# Altium project BB8_BMS.PrjPcb (part 1 of 2)
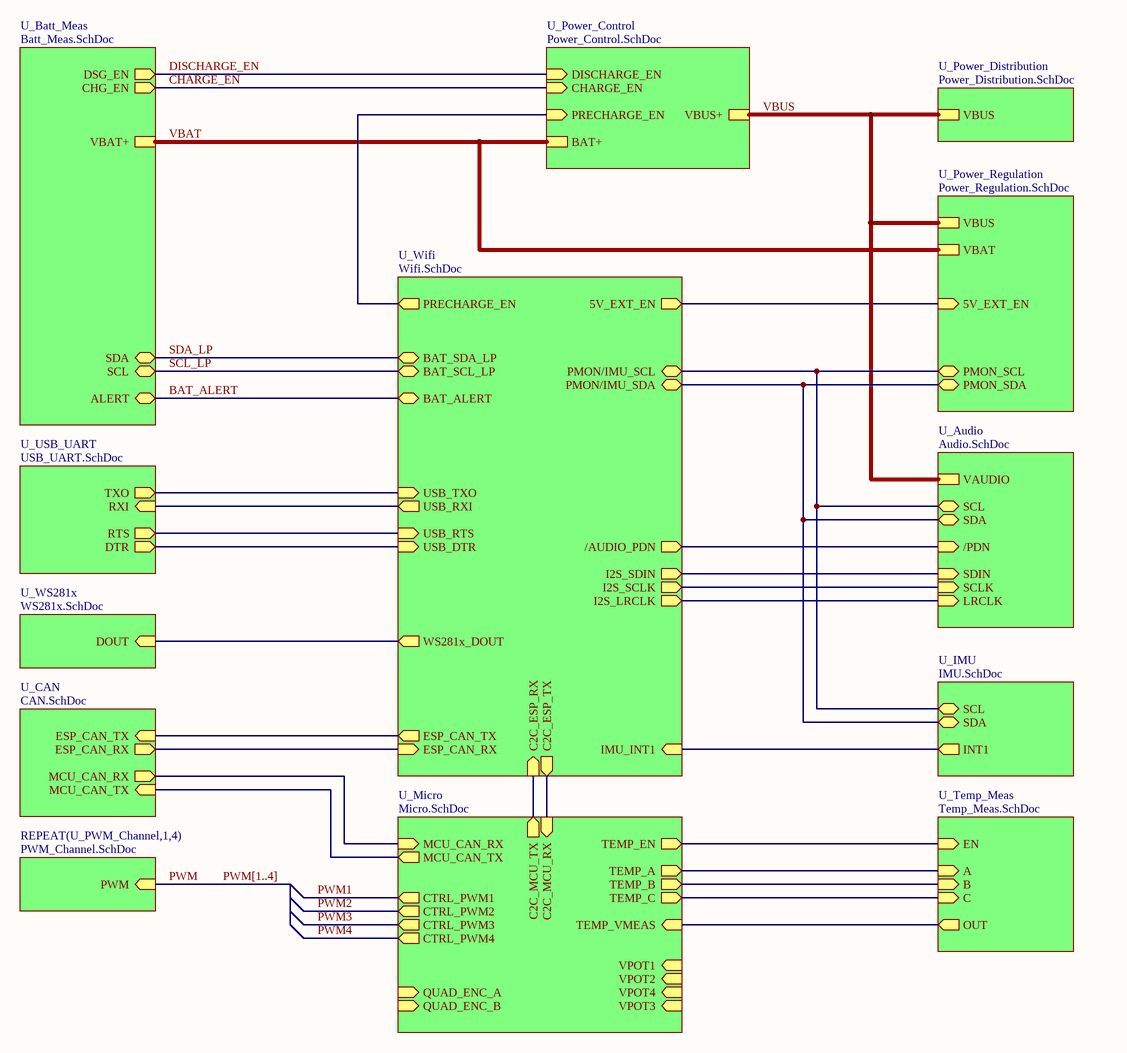
[diagram p0: BB8_BMS.SchDoc]
17 sheets, 214 parts. Net scope: hierarchical (ports join the sheet entries above them; power ports are global).
Board file: BB8_BMS.PcbDoc
Sheets:
  BB8_BMS.SchDoc
    U_Batt_Meas = Batt_Meas.SchDoc
    U_Power_Control = Power_Control.SchDoc
    U_Wifi = Wifi.SchDoc
    U_Power_Distribution = Power_Distribution.SchDoc
    U_Power_Regulation = Power_Regulation.SchDoc
      U_3V3_Regulator = 3V3_Regulator.SchDoc
      U_Ext_Regulators = Ext_Regulators.SchDoc
    U_Temp_Meas = Temp_Meas.SchDoc
      U_Temp_Mux = Temp_Mux.SchDoc
    U_IMU = IMU.SchDoc
    U_USB_UART = USB_UART.SchDoc
    U_CAN = CAN.SchDoc
    U_Audio = Audio.SchDoc
    U_PWM_Channel1 = PWM_Channel.SchDoc
    U_PWM_Channel2 = PWM_Channel.SchDoc
    U_PWM_Channel3 = PWM_Channel.SchDoc
    U_PWM_Channel4 = PWM_Channel.SchDoc
    U_WS281x = WS281x.SchDoc
    U_Micro = Micro.SchDoc

## Sheet BB8_BMS.SchDoc
size B

### Sub-sheets
REPEAT(U_PWM_Channel,1,4) = PWM_Channel.SchDoc: PWM (in)
U_Audio = Audio.SchDoc: VAUDIO, /PDN (in), SDA (bidir), SCL (bidir), SDIN (in), SCLK (in), LRCLK (in)
U_Batt_Meas = Batt_Meas.SchDoc: SCL (bidir), SDA (bidir), VBAT+, CHG_EN (out), DSG_EN (out), ALERT (bidir)
U_CAN = CAN.SchDoc: MCU_CAN_RX (out), MCU_CAN_TX (in), ESP_CAN_TX (in), ESP_CAN_RX (out)
U_IMU = IMU.SchDoc: INT1 (out), SDA (bidir), SCL (bidir)
U_Micro = Micro.SchDoc: TEMP_A (out), TEMP_B (out), TEMP_VMEAS (in), TEMP_C (out), TEMP_EN (out), CTRL_PWM1 (out), CTRL_PWM2 (out), CTRL_PWM3 (out), CTRL_PWM4 (out), C2C_MCU_TX (out), C2C_MCU_RX (in), MCU_CAN_RX (in), MCU_CAN_TX (out), VPOT3 (in), VPOT1 (in), QUAD_ENC_A (in), VPOT4 (in), QUAD_ENC_B (in), VPOT2 (in)
U_Power_Control = Power_Control.SchDoc: BAT+, VBUS+, DISCHARGE_EN (in), CHARGE_EN (in), PRECHARGE_EN (in)
U_Power_Distribution = Power_Distribution.SchDoc: VBUS
U_Power_Regulation = Power_Regulation.SchDoc: VBUS, VBAT, 5V_EXT_EN (in), PMON_SCL (bidir), PMON_SDA (bidir)
U_Temp_Meas = Temp_Meas.SchDoc: A (in), B (in), OUT (out), C (in), EN (in)
U_USB_UART = USB_UART.SchDoc: RXI (in), TXO (out), RTS (out), DTR (out)
U_Wifi = Wifi.SchDoc: USB_TXO (in), USB_RXI (out), USB_RTS (in), USB_DTR (in), IMU_INT1 (in), BAT_ALERT (bidir), BAT_SCL_LP (bidir), BAT_SDA_LP (bidir), 5V_EXT_EN (out), PMON/IMU_SCL (bidir), PMON/IMU_SDA (bidir), PRECHARGE_EN (out), ESP_CAN_TX (out), ESP_CAN_RX (in), /AUDIO_PDN (out), I2S_SDIN (out), I2S_SCLK (out), I2S_LRCLK (out), WS281x_DOUT (out), C2C_ESP_RX (in), C2C_ESP_TX (out)
U_WS281x = WS281x.SchDoc: DOUT (in)

### Nets
5V_EN: sheet U_Wifi/5V_EXT_EN, sheet U_Power_Regulation/5V_EXT_EN
/BOOT: sheet U_Wifi//AUDIO_PDN, sheet U_Audio//PDN
A: sheet U_Temp_Meas/A, sheet U_Micro/TEMP_A
B: sheet U_Temp_Meas/B, sheet U_Micro/TEMP_B
BAT_ALERT: sheet U_Batt_Meas/ALERT, sheet U_Wifi/BAT_ALERT  [project net Alert]
C: sheet U_Temp_Meas/C, sheet U_Micro/TEMP_C
C2C_ESP_RX: sheet U_Wifi/C2C_ESP_RX, sheet U_Micro/C2C_MCU_TX
C2C_ESP_TX: sheet U_Wifi/C2C_ESP_TX, sheet U_Micro/C2C_MCU_RX
CHARGE_EN: sheet U_Batt_Meas/CHG_EN, sheet U_Power_Control/CHARGE_EN
DISCHARGE_EN: sheet U_Batt_Meas/DSG_EN, sheet U_Power_Control/DISCHARGE_EN
DOUT: sheet U_Wifi/WS281x_DOUT, sheet U_WS281x/DOUT
DTR: sheet U_Wifi/USB_DTR, sheet U_USB_UART/DTR
EN: sheet U_Temp_Meas/EN, sheet U_Micro/TEMP_EN
ESP_CAN_RX: sheet U_Wifi/ESP_CAN_RX, sheet U_CAN/ESP_CAN_RX
ESP_CAN_TX: sheet U_Wifi/ESP_CAN_TX, sheet U_CAN/ESP_CAN_TX
I2S_LRCLK: sheet U_Wifi/I2S_LRCLK, sheet U_Audio/LRCLK
I2S_SCLK: sheet U_Wifi/I2S_SCLK, sheet U_Audio/SCLK
I2S_SDIN: sheet U_Wifi/I2S_SDIN, sheet U_Audio/SDIN
IMU_INT1: sheet U_Wifi/IMU_INT1, sheet U_IMU/INT1
MCU_CAN_RX: sheet U_CAN/MCU_CAN_RX, sheet U_Micro/MCU_CAN_RX
MCU_CAN_TX: sheet U_CAN/MCU_CAN_TX, sheet U_Micro/MCU_CAN_TX
OUT: sheet U_Temp_Meas/OUT, sheet U_Micro/TEMP_VMEAS
PMON/IMU_SCL: sheet U_Wifi/PMON/IMU_SCL, sheet U_Power_Regulation/PMON_SCL, sheet U_IMU/SCL, sheet U_Audio/SCL
PMON/IMU_SDA: sheet U_Wifi/PMON/IMU_SDA, sheet U_Power_Regulation/PMON_SDA, sheet U_IMU/SDA, sheet U_Audio/SDA
PRECHARGE_EN: sheet U_Power_Control/PRECHARGE_EN, sheet U_Wifi/PRECHARGE_EN
RTS: sheet U_Wifi/USB_RTS, sheet U_USB_UART/RTS
RXI: sheet U_Wifi/USB_RXI, sheet U_USB_UART/RXI
SCL_LP: sheet U_Batt_Meas/SCL, sheet U_Wifi/BAT_SCL_LP  [project net SCL]
SDA_LP: sheet U_Batt_Meas/SDA, sheet U_Wifi/BAT_SDA_LP  [project net SDA]
TXO: sheet U_Wifi/USB_TXO, sheet U_USB_UART/TXO
VBAT: sheet U_Batt_Meas/VBAT+, sheet U_Power_Control/BAT+, sheet U_Power_Regulation/VBAT
VBUS: sheet U_Power_Control/VBUS+, sheet U_Power_Distribution/VBUS, sheet U_Power_Regulation/VBUS, sheet U_Audio/VAUDIO

### Buses and harness runs
bus PWM[1..4]

## Sheet Batt_Meas.SchDoc
size B
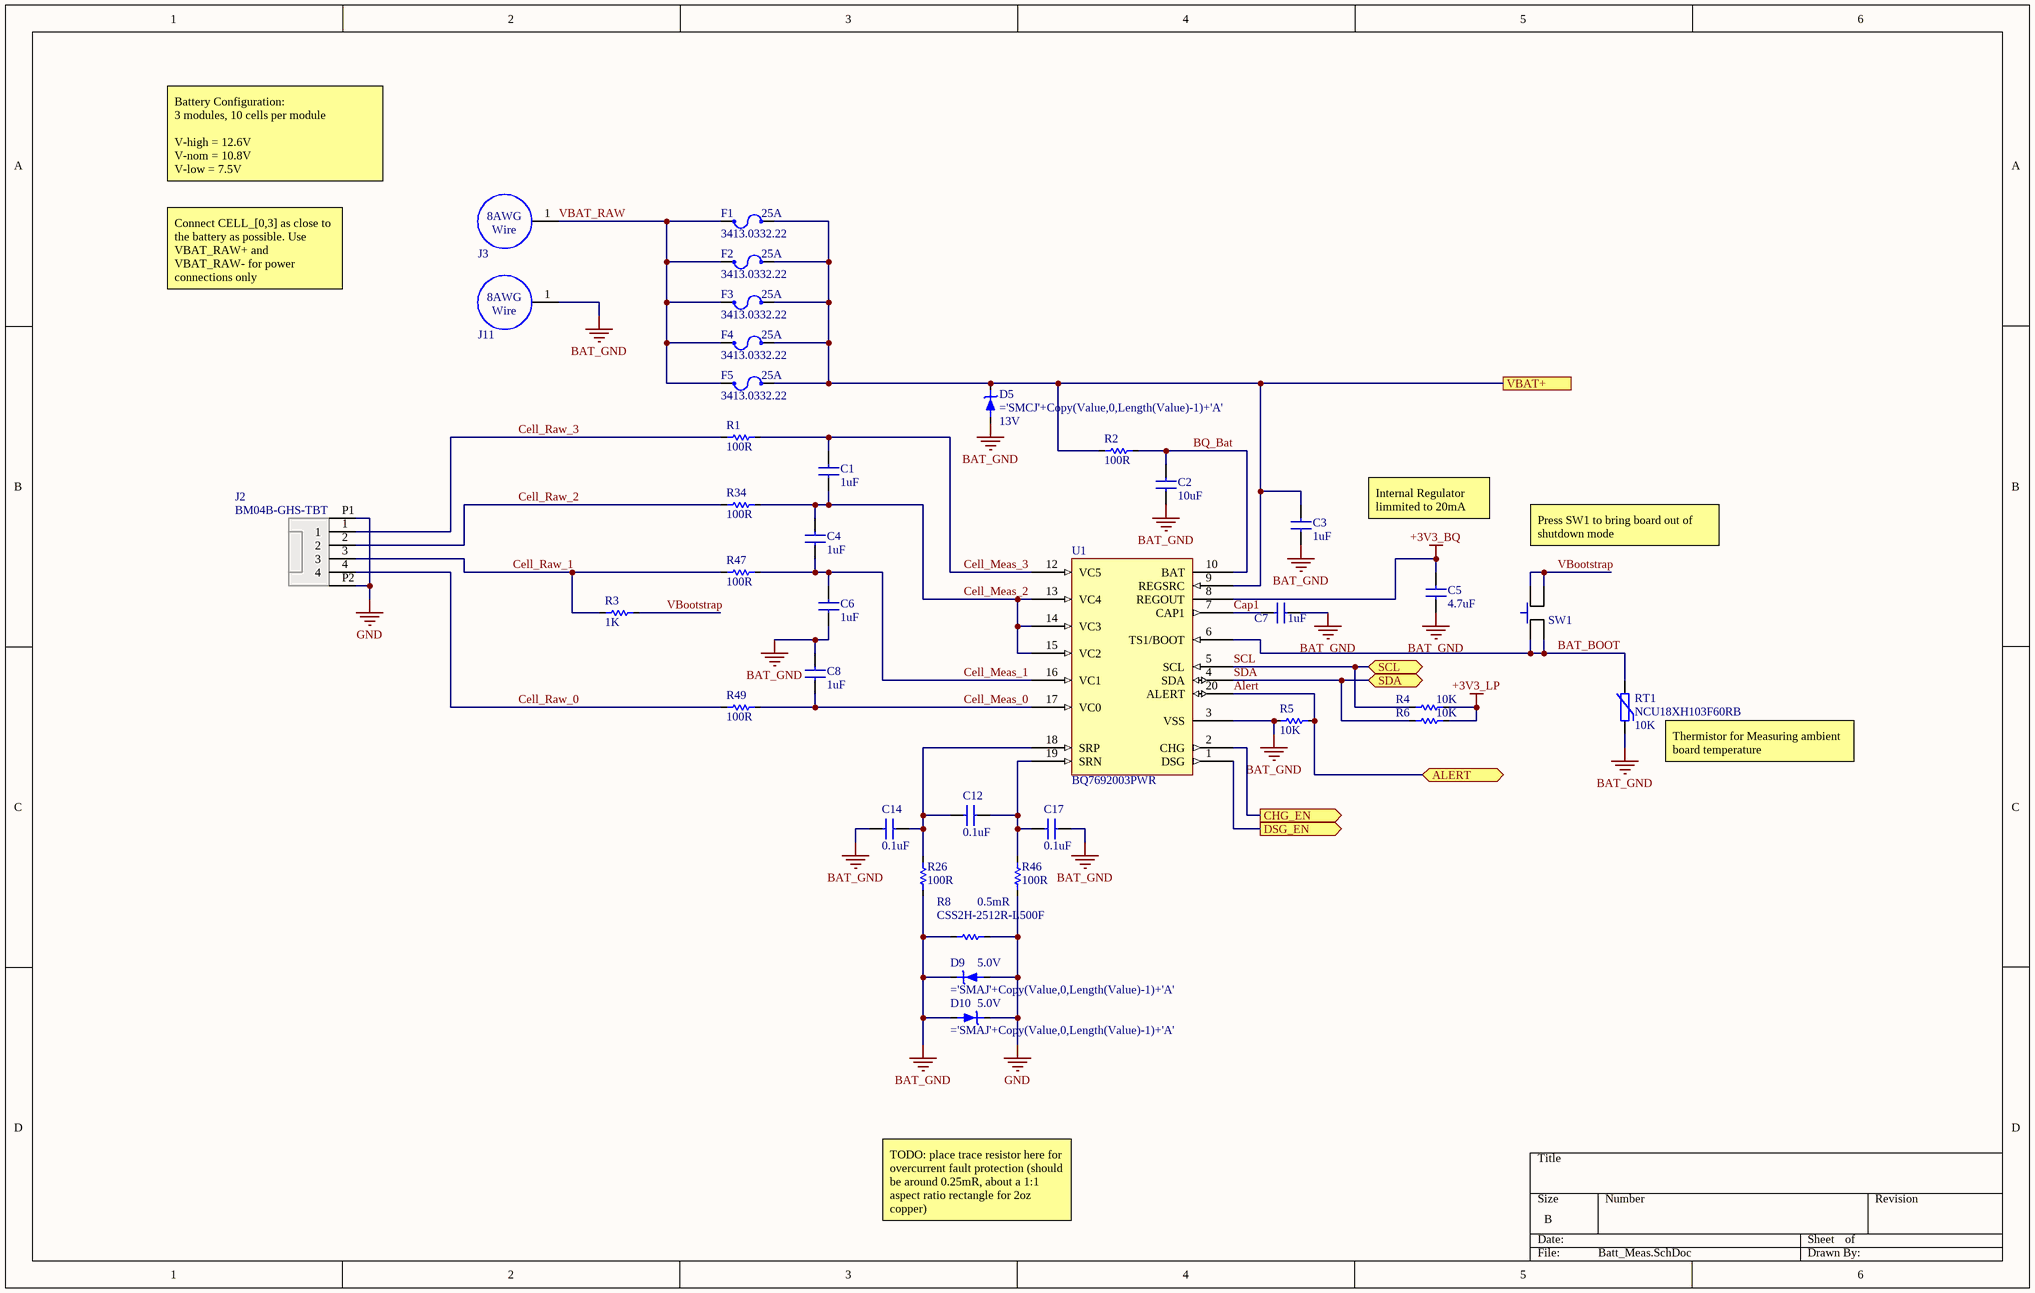
[diagram p1: Batt_Meas.SchDoc]

### Parts
C1  value 1uF  [0603_CAPACITOR]  (hidden comment: CAP 1uF 16V X7R)
C2  value 10uF  [1206_CAPACITOR]  (hidden comment: CAP 10uF 50V X5R)
C3  value 1uF  [0603_CAPACITOR]  (hidden comment: CAP 1uF 16V X7R)
C4  value 1uF  [0603_CAPACITOR]  (hidden comment: CAP 1uF 16V X7R)
C5  value 4.7uF  [0603_Capacitor]  (hidden comment: CAP 4.7uF 6.3V X5R)
C6  value 1uF  [0603_CAPACITOR]  (hidden comment: CAP 1uF 16V X7R)
C7  value 1uF  [0805_Capacitor]  (hidden comment: CAP 1uF 16V X7R)
C8  value 1uF  [0603_CAPACITOR]  (hidden comment: CAP 1uF 16V X7R)
C12  value 0.1uF  [0402_CAPACITOR]  (hidden comment: CAP 0.1uF 16V X7R)
C14  value 0.1uF  [0402_CAPACITOR]  (hidden comment: CAP 0.1uF 16V X7R)
C17  value 0.1uF  [0402_CAPACITOR]  (hidden comment: CAP 0.1uF 16V X7R)
D5  value 13V  [SMC]  (hidden comment: TVS Diode)
D9  value 5.0V  [SMA]  (hidden comment: TVS Diode)
D10  value 5.0V  [SMA]  (hidden comment: TVS Diode)
F1  3413.0332.22  value 25A  [1206_Fuse]
F2  3413.0332.22  value 25A  [1206_Fuse]
F3  3413.0332.22  value 25A  [1206_Fuse]
F4  3413.0332.22  value 25A  [1206_Fuse]
F5  3413.0332.22  value 25A  [1206_Fuse]
J2  BM04B-GHS-TBT  [J_BM04B-GHS-TBT]
J3  8AWG Wire To Board  [Wire_To_Board_8AWG_Red]  (value not drawn)
J11  8AWG Wire To Board  [Wire_To_Board_8AWG_Black]  (value not drawn)
R1  value 100R  [0402_Resistor]  (hidden comment: R_0402_100R_1%)
R2  value 100R  [0402_Resistor]  (hidden comment: R_0402_100R_1%)
R3  value 1K  [0402_Resistor]  (hidden comment: R_0402_1K_1%)
R4  value 10K  [0402_Resistor]  (hidden comment: R_0402_10K_1%)
R5  value 10K  [0402_Resistor]  (hidden comment: R_0402_10K_1%)
R6  value 10K  [0402_Resistor]  (hidden comment: R_0402_10K_1%)
R8  CSS2H-2512R-L500F  value 0.5mR  [2512_Resistor]
R26  value 100R  [0402_Resistor]  (hidden comment: R_0402_100R_1%)
R34  value 100R  [0402_Resistor]  (hidden comment: R_0402_100R_1%)
R46  value 100R  [0402_Resistor]  (hidden comment: R_0402_100R_1%)
R47  value 100R  [0402_Resistor]  (hidden comment: R_0402_100R_1%)
R49  value 100R  [0402_Resistor]  (hidden comment: R_0402_100R_1%)
RT1  NCU18XH103F60RB  value 10K  [0603_Resistor]
SW1  SW_TACT_SWITCH_6x6  [SW_6x6mm_SMD]  (value not drawn)
U1  BQ7692003PWR  [TSSOP-20]

### Ports
ALERT (bidir), CHG_EN (out), DSG_EN (out), SCL (bidir), SDA (bidir), VBAT+

### Nets
+3V3_BQ: C5.1 U1.8(REGOUT)
+3V3_LP: R4.1 R6.1
BAT_GND: C2.2 C3.2 C5.2 C6.2 C7.1 C8.1 C14.1 C17.2 D5.1(Anode) D9.2(Cathode) D10.1(Anode) J11.1 R5.1 R8.1 R26.2 RT1.1 U1.3(VSS)
GND: D9.1(Anode) D10.2(Cathode) J2.P1 J2.P2 R8.2 R46.2
Alert: R5.2 U1.20(ALERT) ; port ALERT
BAT_BOOT: RT1.2 SW1.1 SW1.4 U1.6(TS1/BOOT)
BQ_Bat: C2.1 R2.1 U1.10(BAT)
Cap1: C7.2 U1.7(CAP1)
Cell_Meas_0: C8.2 R49.2 U1.17(VC0)
Cell_Meas_1: C4.2 C6.1 R47.2 U1.16(VC1)
Cell_Meas_2: C1.2 C4.1 R34.2 U1.13(VC4) U1.14(VC3) U1.15(VC2)
Cell_Meas_3: C1.1 R1.2 U1.12(VC5)
Cell_Raw_0: J2.4 R49.1
Cell_Raw_1: J2.3 R3.1 R47.1
Cell_Raw_2: J2.2 R34.1
Cell_Raw_3: J2.1 R1.1
CHARGE_EN: U1.2(CHG) ; port CHG_EN
DISCHARGE_EN: U1.1(DSG) ; port DSG_EN
SCL: R4.2 U1.5(SCL) ; port SCL
SDA: R6.2 U1.4(SDA) ; port SDA
VBAT: C3.1 D5.2(Cathode) F1.2 F2.2 F3.2 F4.2 F5.2 R2.2 U1.9(REGSRC) ; port VBAT+
VBAT_RAW: F1.1 F2.1 F3.1 F4.1 F5.1 J3.1
VBootstrap: R3.2 SW1.2 SW1.3
NetC12_1: C12.1 C14.2 R26.1 U1.18(SRP)
NetC12_2: C12.2 C17.1 R46.1 U1.19(SRN)

### Notes on the sheet
- Battery Configuration:
  3 modules, 10 cells per module
  V-high = 12.6V
  V-nom = 10.8V
  V-low = 7.5V
- Connect CELL_[0,3] as close to the battery as possible. Use VBAT_RAW+ and VBAT_RAW- for power connections only
- Internal Regulator limmited to 20mA
- Press SW1 to bring board out of shutdown mode
- (near RT1) Thermistor for Measuring ambient board temperature
- TODO: place trace resistor here for overcurrent fault protection (should be around 0.25mR, about a 1:1 aspect ratio rectangle for 2oz copper)
- (in symbol J_Wire_To_Board_8AWG) 8AWG; Wire

### Library data of the parts
C1 C3 C4 C6 C8 = C_0603_1uF_16V_10%: CAP CERM 1uF 10% 16V 0603; SVP Creator: Spencer Berglund; Package: =SelectedPackage; Voltage: 16V; Temperature Coefficient: X7R; Supplier 1: Digi-Key; Supplier Part Number 1: 1276-6524-6-ND
C2 = C_1206_10uF_50V_20%: CAP CERM 10uF 20% 50V 1206; SVP Creator: Spencer Berglund; Package: =SelectedPackage; Voltage: 50V; Temperature Coefficient: X5R; Supplier 1: Digi-Key; Supplier Part Number 1: 1276-6736-6-ND
C5 = C_0603_4.7uF_6.3V_10%: CAP CER 4.7UF 6.3V X5R 0603; Package: =SelectedPackage; Voltage: 6.3V; Temperature Coefficient: X5R; Supplier 1: Digi-Key; Supplier Part Number 1: 1276-1045-1-ND
C7 = C_0805_1uF_16V_10%: CAP CERM 1uF 10% 16V 0805; SVP Creator: Spencer Berglund; Package: =SelectedPackage; Voltage: 16V; Temperature Coefficient: X7R; Supplier 1: Digi-Key; Supplier Part Number 1: 1276-6471-1-ND
C12 C14 C17 = C_0402_0.1uF_16V_10%: CAP CERM 0.1uF 10% 16V 0402; Package: =SelectedPackage; Voltage: 16V; Temperature Coefficient: X7R; Supplier 1: Digi-Key; Supplier Part Number 1: 1276-1001-1-ND; Supplier 2: Digi-Key; Supplier Part Number 2: 587-1451-1-ND
D5 = D_TVS_SMCJ_Uni_generic: SMC Unidirectional TVS Diode; Manufacturer: Vishay; Power - Peak Pulse: 1500W; Type: Zener; Power - Dissipation: 6.5W; Operating Temperature: -55°C ~ 150°C; HelpURL: http://www.vishay.com/docs/88394/smcj.pdf; Manufacturer PN: ='SMCJ'+Copy(Value,0,Length(Value)-1)+'A'
D9 D10 = D_TVS_SMAJ_Uni_generic: SMA Unidirectional TVS Diode; Manufacturer: Vishay; Power - Peak Pulse: 400W; Type: Zener; Operating Temperature: -55°C ~ 150°C; HelpURL: http://www.vishay.com/docs/88392/smbj.pdf; Manufacturer PN: ='SMAJ'+Copy(Value,0,Length(Value)-1)+'A'
F1-F5 = F_3413.0332.22: FUSE BOARD MOUNT 25A 32VAC 63VDC; Response Time: Slow; Voltage Rating - AC: 32V; Voltage Rating - DC: 63V; Supplier 1: Digi-Key; Supplier Part Number 1: 486-1690-6-ND
J2 = J_BM04B-GHS-TBT: Connector Header Surface Mount 4 position 0.049" (1.25mm); Manufacturer: JST; Manufacturer Part Number: BM04B-GHS-TBT(LF)(SN); Current Rating: 1A; Gender: Male; Voltage Rating: 50V; Wire/Cable Gauge: 26AWG; Supplier 1: Digi-Key; Supplier Part Number 1: 455-1580-1-ND; Contact Material: Bronze; Contact Plating: Tin; Housing Color: Natural; Max Operating Temperature: 85°C; Min Operating Temperature: -25°C; Housing Material: Nylon; Voltage Rating (AC): 50V; Termination: Crimp; Pitch: 1.25mm; Orientation: Straight
J3 J11 = J_Wire_To_Board_8AWG: 8AWG Stranded Wire Thru-Hole Pad
R1-R6 R26 R34 R46 R47 R49 = R_0402_generic_1%: Generic 0402 Resistor (10.2R to 10M); Manufacturer: Yageo; Power Rating: 0.0625W; Temperature Coefficient: ±100ppm/°C; Tolerance: ±1%; Voltage Rating: 50V; Operating Temperature: -55°C ~ 155°C; Manufacturer Part Number: ='RC0402FR-07'+ValueFormatted+'L'; HelpURL: https://www.digikey.com/products/en/resistors/chip-resistor-surface-mount/52?pv17=103&FV=fffc000d%2Cc0001%2C1c0002%2C1f140000%2Cffe00034&k=RC0402; ValueFormatted: =Copy(Copy(Value, 0, Pos('.', Value)-1)+Copy(Value, Length(Value), 1)+Copy(Value, Pos('.', Value)+1, Length(Value)-Pos('.', Value)-1),1,Pos('.',Value)*Length(Value))+Copy(Value,1,Length(Value)*(1-Pos('.',Value)))
R8 = R_CSS2H-2512R-L500F: 500 µOhms ±1% 6W Chip Resistor 2512 (6432 Metric) Current Sense, Moisture Resistant Metal Element; Manufacturer: Bourns; Temperature Coefficient: 50ppm/°C; Supplier 1: Digi-Key; Supplier Part Number 1: CSS2H-2512R-L500FCT-ND; Min Operating Temperature: -55°C; Max Power Dissipation: 6W; Case/Package: 2512; Tolerance: 1%; Power Rating: 6W; Length: 0.25inch; Max Operating Temperature: 170°C; Manufacturer Part Number: CSS2H-2512R-L500F; Height: 0.037inch; Resistance: 0.5mR
RT1 = RT_NCU18XH103F60RB: NTC Thermistor 10k 0603 (1608 Metric); Manufacturer: Murata; Supplier 1: Digi-Key; Max Operating Temperature: 125°C; Min Operating Temperature: -40°C; Manufacturer Part Number: NCU18XH103F60RB; Supplier Part Number 1: 490-16279-6-ND
SW1 = SW_TACT_SWITCH_6x6: SWITCH TACT 6MM BLACK 160GF; SVP Creator: Spencer Berglund; Package: 6mm x 6mm; Supplier 1: Digi-Key; Supplier Part Number 1: CKN10425CT-ND
U1 = U_BQ7692003PWR: Battery Battery Monitor IC Multi-Chemistry 20-TSSOP; Supplier 1: Digi-Key; Supplier Part Number 1: 296-39959-6-ND

## Sheet Power_Control.SchDoc
size B
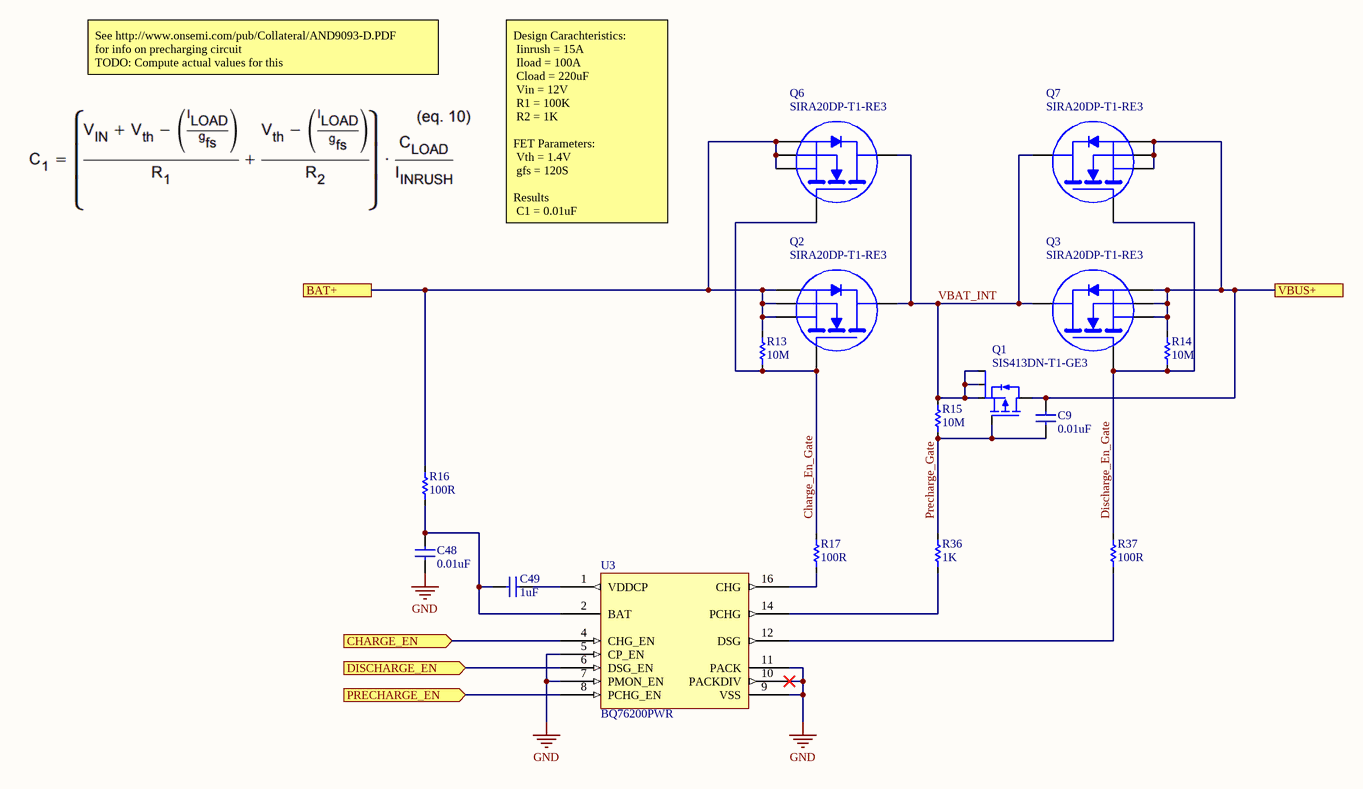
[diagram p2: Power_Control.SchDoc]

### Parts
C9  value 0.01uF  [0402_CAPACITOR]  (hidden comment: CAP 0.01uF 50V X7R)
C48  value 0.01uF  [0402_CAPACITOR]  (hidden comment: CAP 0.01uF 50V X7R)
C49  value 1uF  [1206_CAPACITOR]  (hidden comment: CAP 1uF 25V X7R)
Q1  SIS413DN-T1-GE3  [PowerPAK-1212-8]
Q2  SIRA20DP-T1-RE3  [PowerPAK-SO-8]
Q3  SIRA20DP-T1-RE3  [PowerPAK-SO-8]
Q6  SIRA20DP-T1-RE3  [PowerPAK-SO-8]
Q7  SIRA20DP-T1-RE3  [PowerPAK-SO-8]
R13  value 10M  [0402_Resistor]  (hidden comment: R_0402_10M_1%)
R14  value 10M  [0402_Resistor]  (hidden comment: R_0402_10M_1%)
R15  value 10M  [0402_Resistor]  (hidden comment: R_0402_10M_1%)
R16  value 100R  [0402_Resistor]  (hidden comment: R_0402_100R_1%)
R17  value 100R  [0402_Resistor]  (hidden comment: R_0402_100R_1%)
R36  value 1K  [0402_Resistor]  (hidden comment: R_0402_1K_1%)
R37  value 100R  [0402_Resistor]  (hidden comment: R_0402_100R_1%)
U3  BQ76200PWR  [TSSOP-16]

### Ports
BAT+, CHARGE_EN (in), DISCHARGE_EN (in), PRECHARGE_EN (in), VBUS+

### Nets
GND: C48.2 U3.5(CP_EN) U3.7(PMON_EN) U3.9(VSS) U3.10(PACKDIV) U3.11(PACK)
CHARGE_EN: U3.4(CHG_EN) ; port CHARGE_EN
Charge_En_Gate: Q2.4(GATE) Q6.4(GATE) R13.1 R17.2
DISCHARGE_EN: U3.6(DSG_EN) ; port DISCHARGE_EN
Discharge_En_Gate: Q3.4(GATE) Q7.4(GATE) R14.1 R37.2
PRECHARGE_EN: U3.8(PCHG_EN) ; port PRECHARGE_EN
Precharge_Gate: C9.2 Q1.4(GATE) R15.1 R36.2
VBAT: Q2.1(SOURCE) Q2.2(SOURCE) Q2.3(SOURCE) Q6.1(SOURCE) Q6.2(SOURCE) Q6.3(SOURCE) R13.2 R16.2 ; port BAT+
VBAT_INT: Q1.1(SOURCE) Q1.2(SOURCE) Q1.3(SOURCE) Q2.5(DRAIN) Q3.5(DRAIN) Q6.5(DRAIN) Q7.5(DRAIN) R15.2
VBUS: C9.1 Q1.5(DRAIN) Q3.1(SOURCE) Q3.2(SOURCE) Q3.3(SOURCE) Q7.1(SOURCE) Q7.2(SOURCE) Q7.3(SOURCE) R14.2 ; port VBUS+
NetC48_1: C48.1 C49.1 R16.1 U3.2(BAT)
NetC49_2: C49.2 U3.1(VDDCP)
NetR17_1: R17.1 U3.16(CHG)
NetR36_1: R36.1 U3.14(PCHG)
NetR37_1: R37.1 U3.12(DSG)

### Notes on the sheet
- See http://www.onsemi.com/pub/Collateral/AND9093-D.PDF
  for info on precharging circuit
  TODO: Compute actual values for this
- Design Carachteristics:
  Iinrush = 15A
  Iload = 100A
  Cload = 220uF
  Vin = 12V
  R1 = 100K
  R2 = 1K
  FET Parameters:
  Vth = 1.4V
  gfs = 120S
  Results
  C1 = 0.01uF

### Library data of the parts
C9 C48 = C_0402_0.01uF_50V_10%: CAP CERM 0.01uF 10% 50V 0402; Package: =SelectedPackage; Voltage: 50V; Temperature Coefficient: X7R; Supplier 1: Digi-Key; Supplier Part Number 1: 1276-1028-1-ND
C49 = C_1206_1uF_25V_20%: CAP CERM 1uF 20% 25V 1206; SVP Creator: Spencer Berglund; Package: =SelectedPackage; Voltage: 25V; Temperature Coefficient: X7R; Supplier 1: Digi-Key; Supplier Part Number 1: 1276-3098-1-ND
Q1 = Q_SIS413DN-T1-GE3: P-Channel 30V 18A (Tc) 3.7W (Ta), 52W (Tc) Surface Mount PowerPAK® 1212-8; Manufacturer: Vishay Siliconix; Continuous Drain Current (ID): -18A; Drain to Source Breakdown Voltage: -30V; Drain to Source Resistance: 9.4mR; Fall Time: 8ns; Gate to Source Voltage (Vgs): 20V; Input Capacitance: 4.28nF; Rise Time: 11ns; Threshold Voltage: -2.5V; Turn-Off Delay Time: 45ns; ComponentLink1URL: http://www.st.com/web/en/resource/technical/document/datasheet/CD00001894.pdf; ComponentLink1Description: http://www.st.com/web/en/resource/technical/document/datasheet/CD00001894.pdf; Manufacturer Part Number: SIS413DN-T1-GE3; Supplier 1: Digi-Key; Supplier 2: Mouser; Supplier Part Number 1: SIS413DN-T1-GE3CT-ND; Supplier Part Number 2: 78-SIS413DN-T1-GE3; Drain to Source Voltage (Vdss): -30V; Max Operating Temperature: 150°C; Max Power Dissipation: 52W; Min Operating Temperature: -55°C
Q2 Q3 Q6 Q7 = Q_SIRA20DP-T1-RE3: N-Channel 25V 81.7A (Ta), 100A (Tc) 6.25W (Ta), 104W (Tc) Surface Mount PowerPAK® SO-8; Manufacturer: Vishay; Drive Voltage (Max Rds On, Min Rds On): 4.5V, 10V; Rds On (Max) @ Id, Vgs: 0.58mOhm @ 20A, 10V; Vgs(th) (Max) @ Id: 2.1V @ 250µA; Vgs (Max): +16V, -12V; Input Capacitance (Ciss) (Max) @ Vds: 10850pF @ 10V; Gate Charge (Qg) (Max) @ Vgs: 200nC @ 10V; Supplier 1: Digi-Key; Supplier 2: Mouser; Supplier Part Number 1: SIRA20DP-T1-RE3CT-ND; Supplier Part Number 2: 78-SIRA20DP-T1-RE3; Manufacturer Part Number: SIRA20DP-T1-RE3; Drain to Source Voltage (Vdss): 25V; Current - Continuous Drain (Id) @ 25°C: 81.7A (Ta), 100A (Tc); Power Dissipation (Max): 6.25W (Ta), 104W (Tc); Operating Temperature: -55°C ~ 150°C (TJ)
R13-R17 R36 R37 = R_0402_generic_1%: as R1 on sheet Batt_Meas; Operating Temperature: -55°C ~ 155°C; Manufacturer Part Number: ='RC0402FR-07'+ValueFormatted+'L'; HelpURL: https://www.digikey.com/products/en/resistors/chip-resistor-surface-mount/52?pv17=103&FV=fffc000d%2Cc0001%2C1c0002%2C1f140000%2Cffe00034&k=RC0402; ValueFormatted: =Copy(Copy(Value, 0, Pos('.', Value)-1)+Copy(Value, Length(Value), 1)+Copy(Value, Pos('.', Value)+1, Length(Value)-Pos('.', Value)-1),1,Pos('.',Value)*Length(Value))+Copy(Value,1,Length(Value)*(1-Pos('.',Value)))
U3 = U_BQ76200PWR: Battery Battery Protection IC Lead Acid 16-TSSOP; Supplier 1: Digi-Key; Supplier 2: Mouser; Supplier Part Number 1: 296-43273-1-ND; Supplier Part Number 2: 595-BQ76200PWR

## Sheet Wifi.SchDoc
size B
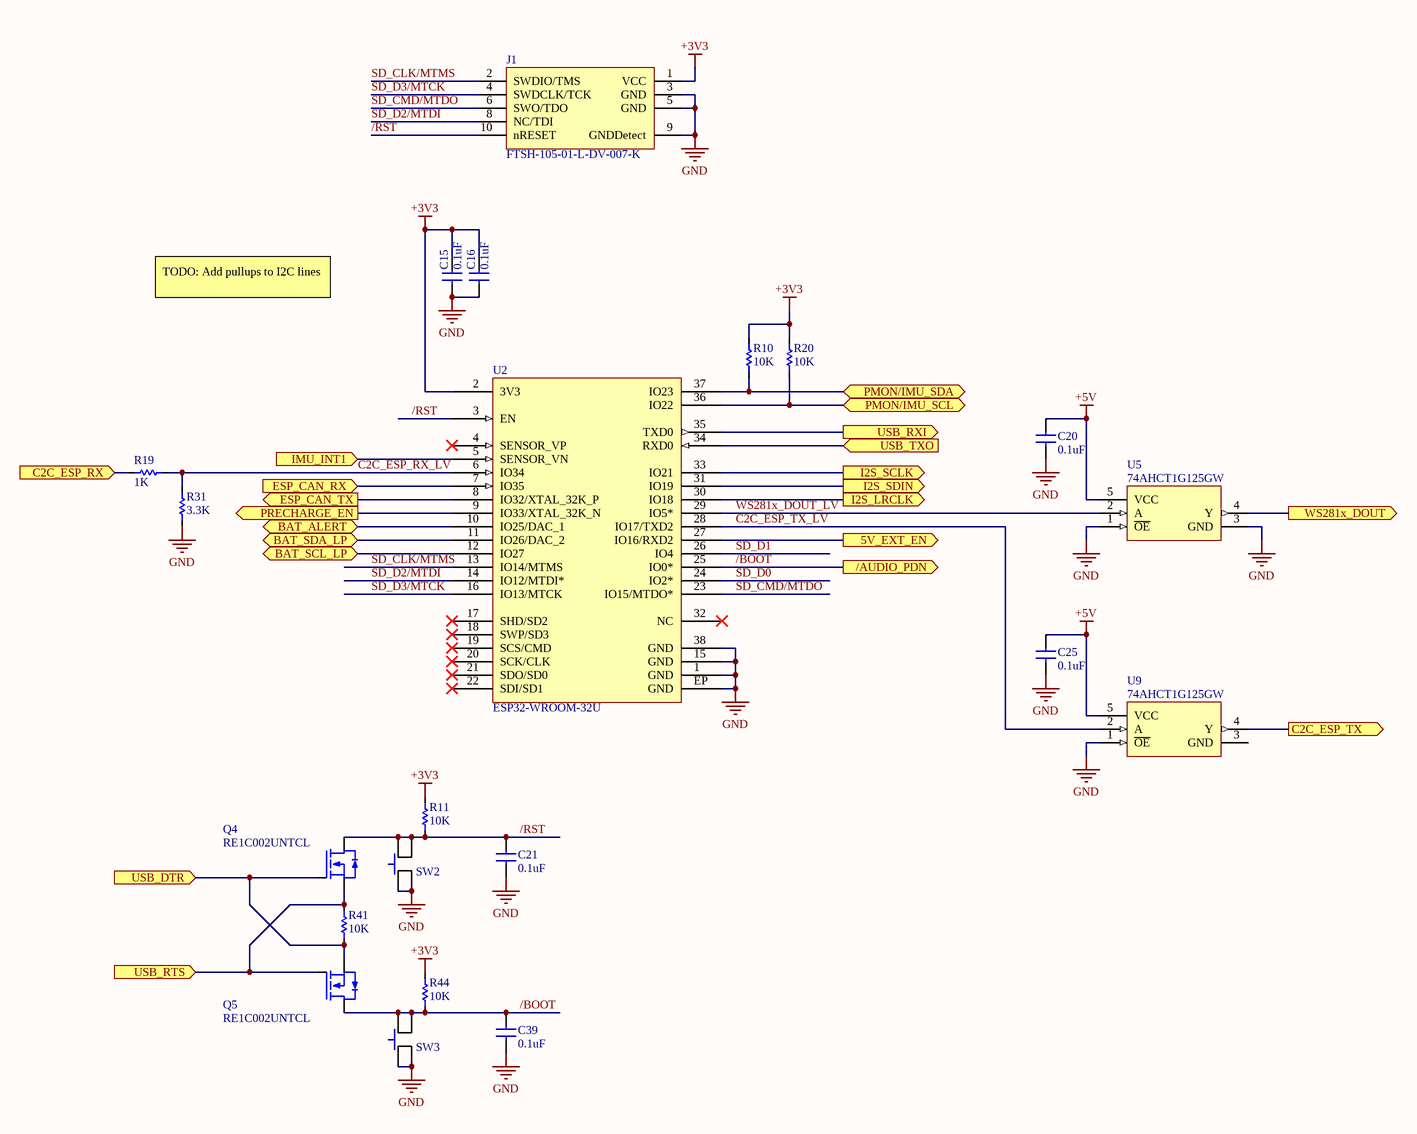
[diagram p3: Wifi.SchDoc]

### Parts
C15  value 0.1uF  [0402_CAPACITOR]  (hidden comment: CAP 0.1uF 16V X7R)
C16  value 0.1uF  [0402_CAPACITOR]  (hidden comment: CAP 0.1uF 16V X7R)
C20  value 0.1uF  [0402_CAPACITOR]  (hidden comment: CAP 0.1uF 16V X7R)
C21  value 0.1uF  [0402_CAPACITOR]  (hidden comment: CAP 0.1uF 16V X7R)
C25  value 0.1uF  [0402_CAPACITOR]  (hidden comment: CAP 0.1uF 16V X7R)
C39  value 0.1uF  [0402_CAPACITOR]  (hidden comment: CAP 0.1uF 16V X7R)
J1  FTSH-105-01-L-DV-007-K  [J_Cortex_JTAG_SMD]
Q4  RE1C002UNTCL  [EMT3F]
Q5  RE1C002UNTCL  [EMT3F]
R10  value 10K  [0402_Resistor]  (hidden comment: R_0402_10K_1%)
R11  value 10K  [0402_Resistor]  (hidden comment: R_0402_10K_1%)
R19  value 1K  [0402_Resistor]  (hidden comment: R_0402_1K_1%)
R20  value 10K  [0402_Resistor]  (hidden comment: R_0402_10K_1%)
R31  value 3.3K  [0402_Resistor]  (hidden comment: R_0402_3.3K_1%)
R41  value 10K  [0402_Resistor]  (hidden comment: R_0402_10K_1%)
R44  value 10K  [0402_Resistor]  (hidden comment: R_0402_10K_1%)
SW2  KSEM31J_LFS  [SW_6x6mm_SMD]  (value not drawn)
SW3  KSEM31J_LFS  [SW_6x6mm_SMD]  (value not drawn)
U2  ESP32-WROOM-32U  [U_ESP32-WROOM-32U]
U5  74AHCT1G125GW  [SC70-5]
U9  74AHCT1G125GW  [SC70-5]

### Ports
5V_EXT_EN (out), /AUDIO_PDN (out), BAT_ALERT (bidir), BAT_SCL_LP (bidir), BAT_SDA_LP (bidir), C2C_ESP_RX (in), C2C_ESP_TX (out), ESP_CAN_RX (in), ESP_CAN_TX (out), I2S_LRCLK (out), I2S_SCLK (out), I2S_SDIN (out), IMU_INT1 (in), PMON/IMU_SCL (bidir), PMON/IMU_SDA (bidir), PRECHARGE_EN (out), USB_DTR (in), USB_RTS (in), USB_RXI (out), USB_TXO (in), WS281x_DOUT (out)

### Nets
+3V3: C15.1 C16.1 J1.1(VCC) R10.1 R11.1 R20.1 R44.1 U2.2(3V3)
+5V: C20.2 C25.2 U5.5(VCC) U9.5(VCC)
GND: C15.2 C16.2 C20.1 C21.1 C25.1 C39.1 J1.3(GND) J1.5(GND) J1.9(GNDDetect) R31.1 SW2.1 SW2.4 SW3.1 SW3.4 U2.1(GND) U2.15(GND) U2.38(GND) U2.EP(GND) U5.1(~{OE}) U5.3(GND) U9.1(~{OE})
5V_EN: U2.27(IO16/RXD2) ; port 5V_EXT_EN
/BOOT: C39.2 Q5.3(DRAIN) R44.2 SW3.2 SW3.3 U2.25(IO0*) ; port /AUDIO_PDN
/RST: C21.2 J1.10(nRESET) Q4.3(DRAIN) R11.2 SW2.2 SW2.3 U2.3(EN)
Alert: U2.10(IO25/DAC_1) ; port BAT_ALERT
C2C_ESP_RX: R19.1 ; port C2C_ESP_RX
C2C_ESP_RX_LV: R19.2 R31.2 U2.6(IO34)
C2C_ESP_TX: U9.4(Y) ; port C2C_ESP_TX
C2C_ESP_TX_LV: U2.28(IO17/TXD2) U9.2(A)
DOUT: U5.4(Y) ; port WS281x_DOUT
DTR: Q4.1(GATE) Q5.2(SOURCE) R41.2 ; port USB_DTR
ESP_CAN_RX: U2.7(IO35) ; port ESP_CAN_RX
ESP_CAN_TX: U2.8(IO32/XTAL_32K_P) ; port ESP_CAN_TX
I2S_LRCLK: U2.30(IO18) ; port I2S_LRCLK
I2S_SCLK: U2.33(IO21) ; port I2S_SCLK
I2S_SDIN: U2.31(IO19) ; port I2S_SDIN
IMU_INT1: U2.5(SENSOR_VN) ; port IMU_INT1
PMON/IMU_SCL: R20.2 U2.36(IO22) ; port PMON/IMU_SCL
PMON/IMU_SDA: R10.2 U2.37(IO23) ; port PMON/IMU_SDA
PRECHARGE_EN: U2.9(IO33/XTAL_32K_N) ; port PRECHARGE_EN
RTS: Q4.2(SOURCE) Q5.1(GATE) R41.1 ; port USB_RTS
RXI: U2.35(TXD0) ; port USB_RXI
SCL: U2.12(IO27) ; port BAT_SCL_LP
SD_CLK/MTMS: J1.2(SWDIO/TMS) U2.13(IO14/MTMS)
SD_CMD/MTDO: J1.6(SWO/TDO) U2.23(IO15/MTDO*)
SD_D0: U2.24(IO2*)
SD_D1: U2.26(IO4)
SD_D2/MTDI: J1.8(NC/TDI) U2.14(IO12/MTDI*)
SD_D3/MTCK: J1.4(SWDCLK/TCK) U2.16(IO13/MTCK)
SDA: U2.11(IO26/DAC_2) ; port BAT_SDA_LP
TXO: U2.34(RXD0) ; port USB_TXO
WS281x_DOUT_LV: U2.29(IO5*) U5.2(A)

Not connected (* = marked no-connect by the designer): U2 4(SENSOR_VP)* 17(SHD/SD2)* 18(SWP/SD3)* 19(SCS/CMD)* 20(SCK/CLK)* 21(SDO/SD0)* 22(SDI/SD1)* 32(NC)*; U9 3(GND)

### Notes on the sheet
- TODO: Add pullups to I2C lines

### Library data of the parts
C15 C16 C20 C21 C25 C39 = C_0402_0.1uF_16V_10%: CAP CERM 0.1uF 10% 16V 0402; Package: =SelectedPackage; Voltage: 16V; Temperature Coefficient: X7R; Supplier 1: Digi-Key; Supplier Part Number 1: 1276-1001-1-ND; Supplier 2: Digi-Key; Supplier Part Number 2: 587-1451-1-ND
J1 = J_Cortex_JTAG_SMD: CORTEX JTAG DEBUG CONNECTOR; Manufacturer: Samtec Inc; Manufacturer PN: FTSH-105-01-L-DV-007-K; Supplier 1: Digi-Key; Supplier Part Number 1: SAM9438-ND
Q4 Q5 = Q_RE1C002UNTCL: N-Channel 20V 200mA (Ta) 150mW (Ta) Surface Mount EMT3F (SOT-416FL); Manufacturer: Rohm; Input Capacitance: 25pF; Rds On Max: 1.2R; Supplier 1: Digi-Key; Supplier 2: Mouser; Supplier Part Number 1: RE1C002UNTCLCT-ND; Supplier Part Number 2: 755-RE1C002UNTCL; Continuous Drain Current (ID): 200mA; Drain to Source Voltage (Vdss): 20V; Manufacturer Part Number: RE1C002UNTCL; Max Power Dissipation: 150mW
R10 R11 R19 R20 R31 R41 R44 = R_0402_generic_1%: as R1 on sheet Batt_Meas; Operating Temperature: -55°C ~ 155°C; Manufacturer Part Number: ='RC0402FR-07'+ValueFormatted+'L'; HelpURL: https://www.digikey.com/products/en/resistors/chip-resistor-surface-mount/52?pv17=103&FV=fffc000d%2Cc0001%2C1c0002%2C1f140000%2Cffe00034&k=RC0402; ValueFormatted: =Copy(Copy(Value, 0, Pos('.', Value)-1)+Copy(Value, Length(Value), 1)+Copy(Value, Pos('.', Value)+1, Length(Value)-Pos('.', Value)-1),1,Pos('.',Value)*Length(Value))+Copy(Value,1,Length(Value)*(1-Pos('.',Value)))
SW2 SW3 = SW_KSEM31J_LFS: Tactile Switch SPST-NO Top Actuated Surface Mount; Package: 6mm x 6mm; Supplier 1: Digi-Key; Supplier Part Number 1: CKN10425CT-ND
U2 = U_ESP32-WROOM-32U: Bluetooth, WiFi 802.11b/g/n, Bluetooth v4.2 + EDR, Class 1, 2 and 3 Transceiver Module 2.4GHz ~ 2.5GHz Integrated, Chip + U.FL Surface Mount; Supplier 1: Digi-Key; Supplier 2: Mouser; Supplier Part Number 1: 1904-1026-1-ND; Supplier Part Number 2: 356-ESP32-WROOM-32U
U5 U9 = U_74AHCT1G125GW: Buffer, Non-Inverting 1 Element 1 Bit per Element 3-State Output 5-TSSOP; Manufacturer: NXP Semiconductors; High Level Output Current: -8mA; Low Level Output Current: 8mA; Max Supply Voltage: 5.5V; Min Supply Voltage: 4.5V; Quiescent Current: 1uA; Propagation Delay: 11ns; Turn-On Delay Time: 9.5ns; Supplier 1: Digi-Key; Supplier 2: Mouser; Supplier Part Number 1: 1727-4055-1-ND; Supplier Part Number 2: 771-74AHCT1G125GW-G; Logic Function: Buffer; Manufacturer Part Number: 74AHCT1G125GW; Max Operating Temperature: 125°C; Min Operating Temperature: -40°C; Polarity: Non-Inverting

## Sheet Power_Distribution.SchDoc
size A
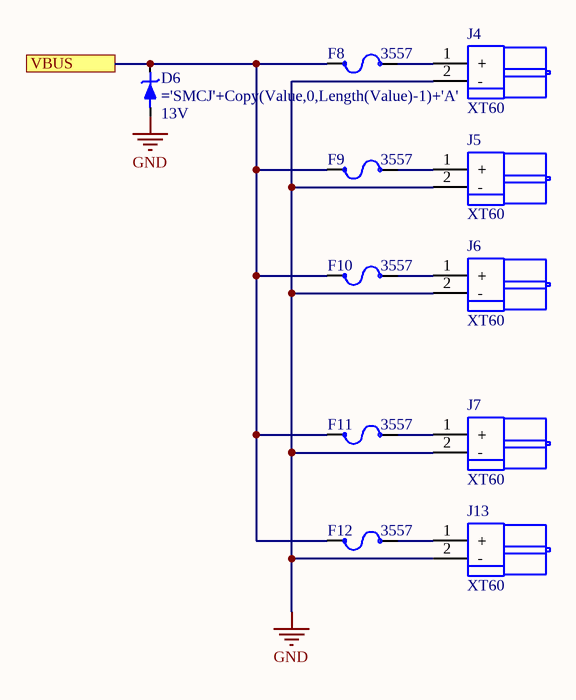
[diagram p4: Power_Distribution.SchDoc]

### Parts
D6  value 13V  [SMC]  (hidden comment: TVS Diode)
F8  3557  [F_3557_Mini]
F9  3557  [F_3557_Mini]
F10  3557  [F_3557_Mini]
F11  3557  [F_3557_Mini]
F12  3557  [F_3557_Mini]
J4  XT60  [J_XT60_Thru_Female]
J5  XT60  [J_XT60_Thru_Female]
J6  XT60  [J_XT60_Thru_Female]
J7  XT60  [J_XT60_SMD_Female]
J13  XT60  [J_XT60_SMD_Female]

### Ports
VBUS

### Nets
GND: D6.1(Anode) J4.2(-) J5.2(-) J6.2(-) J7.2(-) J13.2(-)
VBUS: D6.2(Cathode) F8.1 F9.1 F10.1 F11.1 F12.1 ; port VBUS
NetF8_2: F8.2 J4.1(+)
NetF9_2: F9.2 J5.1(+)
NetF10_2: F10.2 J6.1(+)
NetF11_2: F11.2 J7.1(+)
NetF12_2: F12.2 J13.1(+)

### Library data of the parts
D6 = D_TVS_SMCJ_Uni_generic: as D5 on sheet Batt_Meas; Operating Temperature: -55°C ~ 150°C; HelpURL: http://www.vishay.com/docs/88394/smcj.pdf; Manufacturer PN: ='SMCJ'+Copy(Value,0,Length(Value)-1)+'A'
F8-F12 = F_3557_MINI_ATO: Manufacturer: Keystone Electronics; Material: Brass,Nickel; Body Material: Brass; Current Rating: 30A; Voltage Rating (AC): 500V; Number of Circuits: 1; Fuse Current: 20A; Supplier 1: Digi-Key; Manufacturer Part Number: 3557; Stock 1: 70386; Pricing 1: 1=0.2, 10=0.185, 50=0.145, 100=0.1282, 250=0.1134, 500=0.1085, 1000=0.0887, 2500=0.0813, 5000=0.0789 (USD); Mount: Through Hole,Vertical,PCB; Contact Plating: Nickel,Tin; Contact Material: Brass; Min Operating Temperature: -50°C; Max Operating Temperature: 145°C; Package Quantity: 1; Termination: PC Pin; Orientation: Vertical; Packaging: Bulk; Voltage: 500V; Length: 0.4inch; Height: 0.15inch; Depth: 4.7mm; Width: 0.185inch; REACH SVHC: No SVHC; Lead Free: Lead Free; ComponentLink1URL: https://datasheet.ciiva.com/16425/m60-2p39-16425699.pdf; ComponentLink1Description: https://datasheet.ciiva.com/16425/m60-2p39-16425699.pdf; ComponentLink2URL: https://datasheet.ciiva.com/22650/1686040-22650696.pdf; ComponentLink2Description: https://datasheet.ciiva.com/22650/1686040-22650696.pdf; Supplier Part Number 1: 3557K-ND
J4-J7 J13 = J_XT60: 60 Amp XT60 Connector

## Sheet Power_Regulation.SchDoc
size A
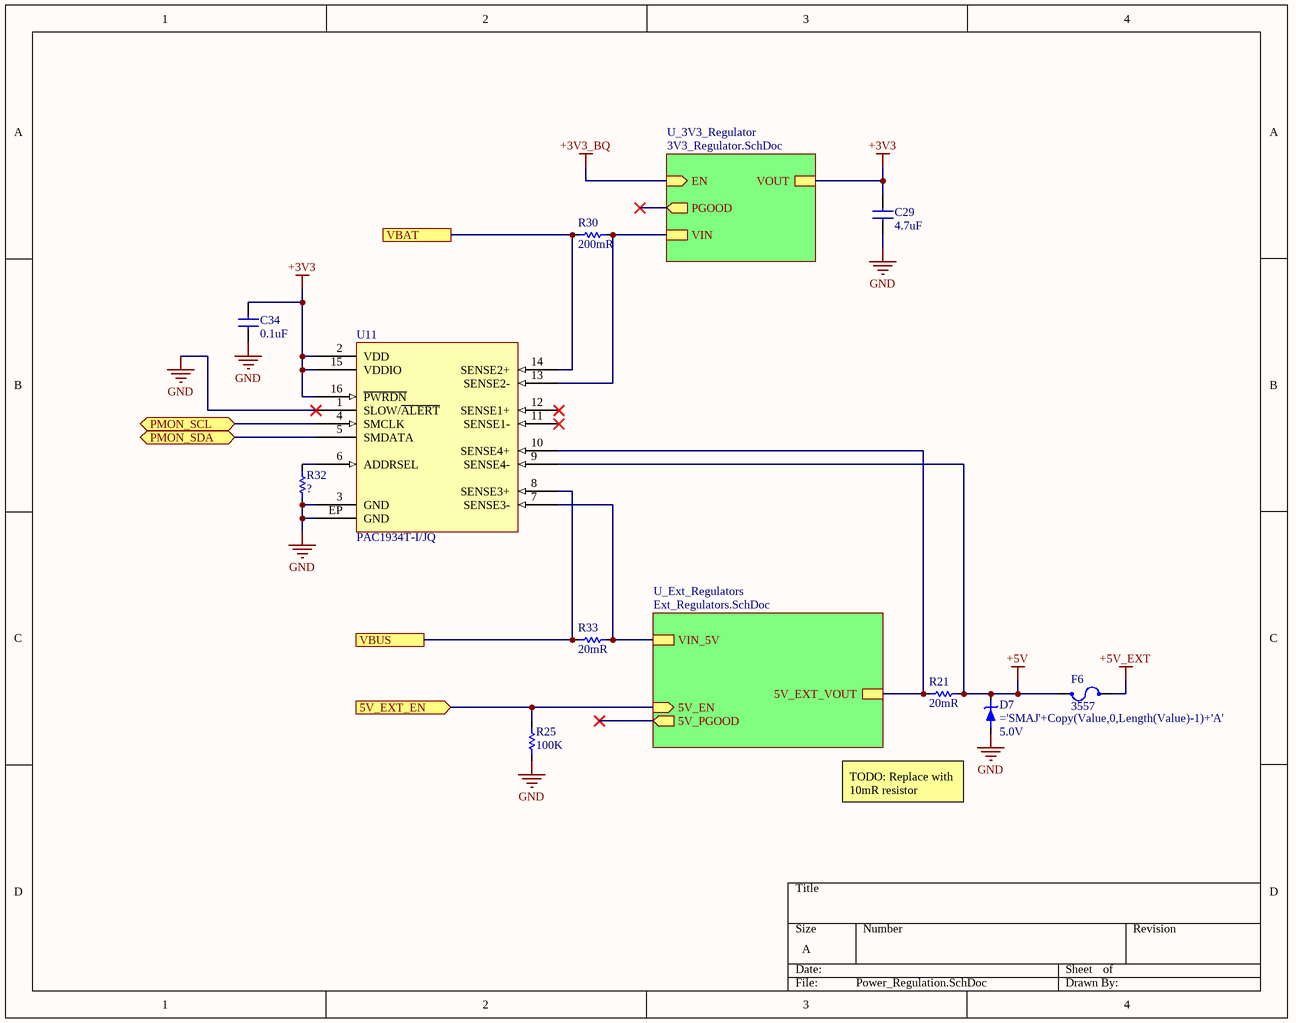
[diagram p5: Power_Regulation.SchDoc]

### Parts
C29  value 4.7uF  [0805_Capacitor]  (hidden comment: CAP 4.7uF 16V X5R)
C34  value 0.1uF  [0402_CAPACITOR]  (hidden comment: CAP 0.1uF 16V X7R)
D7  value 5.0V  [SMA]  (hidden comment: TVS Diode)
F6  3557  [F_3557_Mini]
R21  value 20mR  [0805_Resistor]  (hidden comment: CRF0805-FZ-R020ELF)
R25  value 100K  [0402_Resistor]  (hidden comment: R_0402_100K_1%)
R30  value 200mR  [0603_Resistor]  (hidden comment: CSR0603FKR200)
R32  R_0402_?_1%  [0402_Resistor]  (value not drawn)
R33  value 20mR  [0805_Resistor]  (hidden comment: CRF0805-FZ-R020ELF)
U11  PAC1934T-I/JQ  [QFN-16-EP_4x4mm]

### Sub-sheets
U_3V3_Regulator = 3V3_Regulator.SchDoc: VIN, EN (in), VOUT, PGOOD (out)
U_Ext_Regulators = Ext_Regulators.SchDoc: VIN_5V, 5V_EXT_VOUT, 5V_PGOOD (out), 5V_EN (in)

### Ports
5V_EXT_EN (in), PMON_SCL (bidir), PMON_SDA (bidir), VBAT, VBUS

### Nets
+3V3: C29.1 C34.1 U11.2(VDD) U11.15(VDDIO) U11.16(~{PWRDN}) ; sheet U_3V3_Regulator/VOUT
+5V: D7.2(Cathode) F6.1 R21.2 U11.9(SENSE4-)
+5V_EXT: F6.2
GND: C29.2 C34.2 D7.1(Anode) R25.1 R32.1 U11.1(SLOW/~{ALERT}) U11.3(GND) U11.EP(GND)
5V_EN: R25.2 ; port 5V_EXT_EN, sheet U_Ext_Regulators/5V_EN
5V_EXT_VOUT: R21.1 U11.10(SENSE4+) ; sheet U_Ext_Regulators/5V_EXT_VOUT
PMON/IMU_SCL: U11.4(SMCLK) ; port PMON_SCL
PMON/IMU_SDA: U11.5(SMDATA) ; port PMON_SDA
VBAT: R30.1 U11.14(SENSE2+) ; port VBAT
VBUS: R33.1 U11.8(SENSE3+) ; port VBUS
VIN: R30.2 U11.13(SENSE2-) ; sheet U_3V3_Regulator/VIN
VIN_5V: R33.2 U11.7(SENSE3-) ; sheet U_Ext_Regulators/VIN_5V
NetR32_2: R32.2 U11.6(ADDRSEL)

Not connected (* = marked no-connect by the designer): U11 11(SENSE1-)* 12(SENSE1+)*

### Notes on the sheet
- TODO: Replace with 10mR resistor

### Library data of the parts
C29 = C_0805_4.7uF_16V_10%: CAP CERM 4.7uF 10% 16V 0805; SVP Creator: Spencer Berglund; Package: =SelectedPackage; Voltage: 16V; Temperature Coefficient: X5R; Supplier 1: Digi-Key; Supplier Part Number 1: 1276-1065-6-ND
C34 = C_0402_0.1uF_16V_10%: CAP CERM 0.1uF 10% 16V 0402; Package: =SelectedPackage; Voltage: 16V; Temperature Coefficient: X7R; Supplier 1: Digi-Key; Supplier Part Number 1: 1276-1001-1-ND; Supplier 2: Digi-Key; Supplier Part Number 2: 587-1451-1-ND
D7 = D_TVS_SMAJ_Uni_generic: as D9 on sheet Batt_Meas; Operating Temperature: -55°C ~ 150°C; HelpURL: http://www.vishay.com/docs/88392/smbj.pdf; Manufacturer PN: ='SMAJ'+Copy(Value,0,Length(Value)-1)+'A'
F6 = F_3557_MINI_ATO: as F8 on sheet Power_Distribution; Supplier 1: Digi-Key; Manufacturer Part Number: 3557; Stock 1: 70386; Pricing 1: 1=0.2, 10=0.185, 50=0.145, 100=0.1282, 250=0.1134, 500=0.1085, 1000=0.0887, 2500=0.0813, 5000=0.0789 (USD); Mount: Through Hole,Vertical,PCB; Contact Plating: Nickel,Tin; Contact Material: Brass; Min Operating Temperature: -50°C; Max Operating Temperature: 145°C; Package Quantity: 1; Termination: PC Pin; Orientation: Vertical; Packaging: Bulk; Voltage: 500V; Length: 0.4inch; Height: 0.15inch; Depth: 4.7mm; Width: 0.185inch; REACH SVHC: No SVHC; Lead Free: Lead Free; ComponentLink1URL: https://datasheet.ciiva.com/16425/m60-2p39-16425699.pdf; ComponentLink1Description: https://datasheet.ciiva.com/16425/m60-2p39-16425699.pdf; ComponentLink2URL: https://datasheet.ciiva.com/22650/1686040-22650696.pdf; ComponentLink2Description: https://datasheet.ciiva.com/22650/1686040-22650696.pdf; Supplier Part Number 1: 3557K-ND
R21 R33 = R_CRF0805-FZ-R020ELF: 20 mOhms ±1% 0.5W, 1/2W Chip Resistor 0805 (2012 Metric) Automotive AEC-Q200, Current Sense, Moisture Resistant Metal Element; Manufacturer: Bourns; Temperature Coefficient: 50ppm/°C; Min Operating Temperature: -55°C; Max Power Dissipation: 0.5W; Manufacturer Part Number: CRF0805-FZ-R020ELF; Max Operating Temperature: 170°C; Composition: Metal Element; Tolerance: 1%; Supplier 1: Digi-Key; Supplier Part Number 1: CRF0805-FZ-R020ELFDKR-ND
R25 R32 = R_0402_generic_1%: as R1 on sheet Batt_Meas; Operating Temperature: -55°C ~ 155°C; Manufacturer Part Number: ='RC0402FR-07'+ValueFormatted+'L'; HelpURL: https://www.digikey.com/products/en/resistors/chip-resistor-surface-mount/52?pv17=103&FV=fffc000d%2Cc0001%2C1c0002%2C1f140000%2Cffe00034&k=RC0402; ValueFormatted: =Copy(Copy(Value, 0, Pos('.', Value)-1)+Copy(Value, Length(Value), 1)+Copy(Value, Pos('.', Value)+1, Length(Value)-Pos('.', Value)-1),1,Pos('.',Value)*Length(Value))+Copy(Value,1,Length(Value)*(1-Pos('.',Value)))
  R32: Value: ?
R30 = R_CSR0603FKR200: 200 mOhms ±1% 0.125W, 1/8W Chip Resistor 0603 (1608 Metric) Current Sense Thick Film; Manufacturer: Stackpole Electronics; Temperature Coefficient: 300ppm/°C; Min Operating Temperature: -55°C; Max Power Dissipation: 0.125W; Manufacturer Part Number: CSR0603FKR200; Max Operating Temperature: 155°C; Composition: Thick Film; Tolerance: 1%; Supplier 1: Digi-Key; Supplier Part Number 1: CSR0603FKR200CT-ND
U11 = U_PAC1934T-I/JQ: Current Monitor Regulator High-Side 16-UQFN (4x4); Supplier 1: Digi-Key; Supplier Part Number 1: PAC1934T-I/JQCT-ND

## Sheet 3V3_Regulator.SchDoc
size A
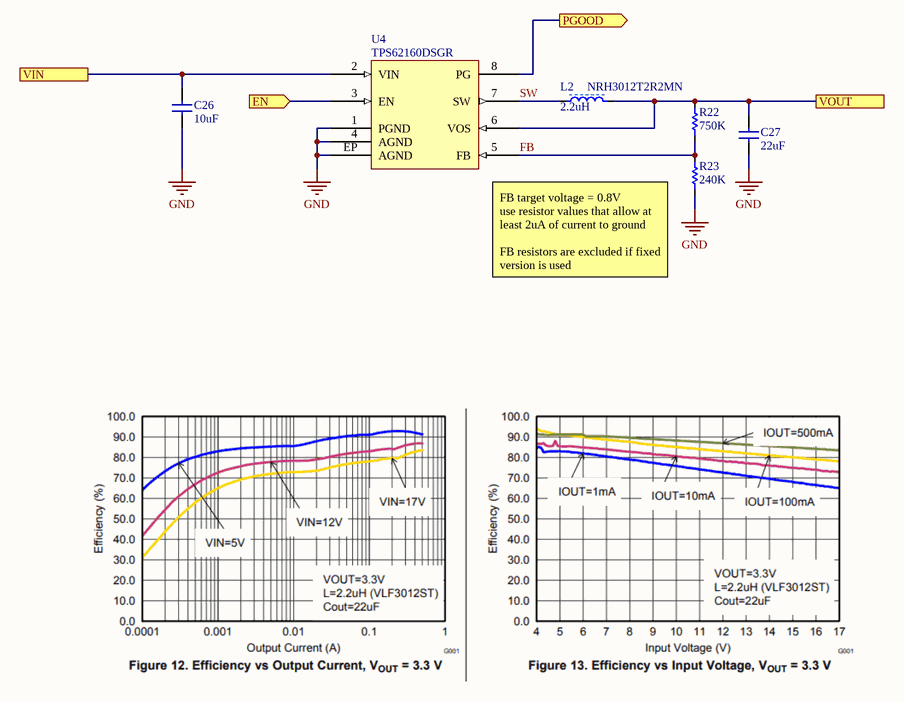
[diagram p6: 3V3_Regulator.SchDoc]

### Parts
C26  value 10uF  [0805_Capacitor]  (hidden comment: CAP 10uF 25V X5R)
C27  value 22uF  [0805_Capacitor]  (hidden comment: CAP 22uF 16V X5R)
L2  NRH3012T2R2MN  value 2.2uH  [L_NR_Series_3.0x3.0mm]
R22  value 750K  [0402_Resistor]  (hidden comment: R_0402_750K_1%)
R23  value 240K  [0402_Resistor]  (hidden comment: R_0402_240K_1%)
U4  TPS62160DSGR  [WFDFN-8-EP]

### Ports
EN (in), PGOOD (out), VIN, VOUT

### Nets
+3V3: C27.1 L2.2 R22.2 U4.6(VOS) ; port VOUT
+3V3_BQ: U4.3(EN) ; port EN
GND: C26.2 C27.2 R23.1 U4.1(PGND) U4.4(AGND) U4.EP(AGND)
FB: R22.1 R23.2 U4.5(FB)
PGOOD: U4.8(PG) ; port PGOOD
SW: L2.1 U4.7(SW)
VIN: C26.1 U4.2(VIN) ; port VIN

### Notes on the sheet
- FB target voltage = 0.8V
  use resistor values that allow at least 2uA of current to ground
  FB resistors are excluded if fixed version is used

### Library data of the parts
C26 = C_0805_10uF_25V_10%: CAP CER 10UF 25V X5R 0805; Package: =SelectedPackage; Voltage: 25V; Temperature Coefficient: X5R; Supplier 1: Digi-Key; Supplier Part Number 1: 1276-2891-1-ND
C27 = C_0805_22uF_16V_20%: CAP CERM 22uF 20% 16V 0805; Package: =SelectedPackage; Voltage: 16V; Temperature Coefficient: X5R; Supplier 1: Digi-Key; Supplier Part Number 1: 1276-6780-6-ND
L2 = L_NRH3012T2R2MN: 2.2µH Shielded Wirewound Inductor 1.37A 90mOhm Max Nonstandard; Manufacturer: Taiyo Yuden; Test Frequency: 100kHz; Saturation Current: 1.5A; Core Material: Ferrite; Tolerance: 20%; DC Resistance (DCR): 90mR; Self Resonant Frequency: 78MHz; Current Rating: 1.37A; Max Operating Temperature: 120°C; Composition: Wirewound; Shielding: Shielded; Min Operating Temperature: -25°C; Case/Package: Nonstandard; Manufacturer Part Number: NRH3012T2R2MN; Supplier 1: Digi-Key; Supplier Part Number 1: 587-2589-1-ND
R22 R23 = R_0402_generic_1%: as R1 on sheet Batt_Meas; Operating Temperature: -55°C ~ 155°C; Manufacturer Part Number: ='RC0402FR-07'+ValueFormatted+'L'; HelpURL: https://www.digikey.com/products/en/resistors/chip-resistor-surface-mount/52?pv17=103&FV=fffc000d%2Cc0001%2C1c0002%2C1f140000%2Cffe00034&k=RC0402; ValueFormatted: =Copy(Copy(Value, 0, Pos('.', Value)-1)+Copy(Value, Length(Value), 1)+Copy(Value, Pos('.', Value)+1, Length(Value)-Pos('.', Value)-1),1,Pos('.',Value)*Length(Value))+Copy(Value,1,Length(Value)*(1-Pos('.',Value)))
U4 = U_TPS62160: Buck Switching Regulator IC Positive Adjustable 0.9V 1 Output 1A; Supplier 1: Digi-Key; Supplier Part Number 1: 296-29895-6-ND

## Sheet Ext_Regulators.SchDoc
size A
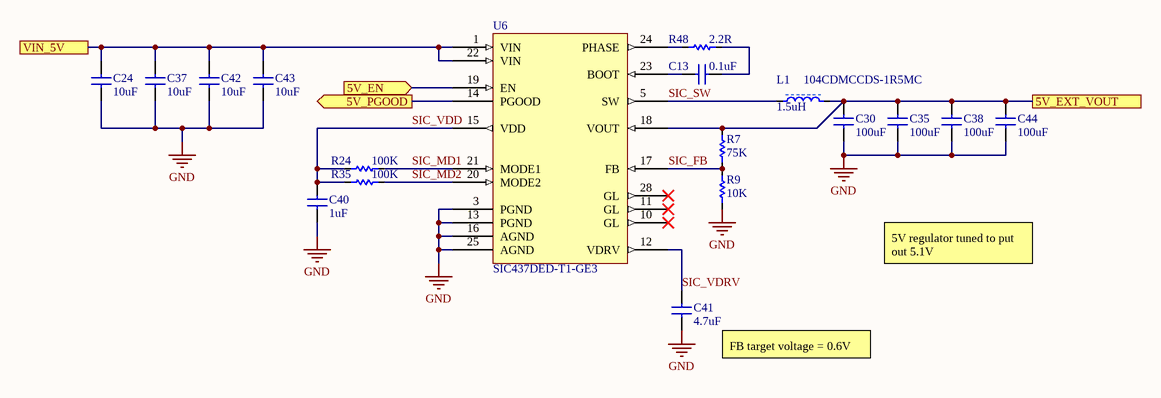
[diagram p7: Ext_Regulators.SchDoc]

### Parts
C13  value 0.1uF  [0402_CAPACITOR]  (hidden comment: CAP 0.1uF 16V X7R)
C24  value 10uF  [0805_Capacitor]  (hidden comment: CAP 10uF 25V X5R)
C30  value 100uF  [1210_Capacitor]  (hidden comment: C3225X5R0J107M250AC)
C35  value 100uF  [1210_Capacitor]  (hidden comment: C3225X5R0J107M250AC)
C37  value 10uF  [0805_Capacitor]  (hidden comment: CAP 10uF 25V X5R)
C38  value 100uF  [1210_Capacitor]  (hidden comment: C3225X5R0J107M250AC)
C40  value 1uF  [0603_CAPACITOR]  (hidden comment: CAP 1uF 16V X7R)
C41  value 4.7uF  [0805_Capacitor]  (hidden comment: CAP 4.7uF 16V X5R)
C42  value 10uF  [0805_Capacitor]  (hidden comment: CAP 10uF 25V X5R)
C43  value 10uF  [0805_Capacitor]  (hidden comment: CAP 10uF 25V X5R)
C44  value 100uF  [1210_Capacitor]  (hidden comment: C3225X5R0J107M250AC)
L1  104CDMCCDS-1R5MC  value 1.5uH  [L_104CDMCCDS]
R7  value 75K  [0402_Resistor]  (hidden comment: R_0402_75K_1%)
R9  value 10K  [0402_Resistor]  (hidden comment: R_0402_10K_1%)
R24  value 100K  [0402_Resistor]  (hidden comment: R_0402_100K_1%)
R35  value 100K  [0402_Resistor]  (hidden comment: R_0402_100K_1%)
R48  value 2.2R  [0402_Resistor]  (hidden comment: R_0402_2.2R_1%)
U6  SIC437DED-T1-GE3  [U_MLP44-24L]

### Ports
5V_EN (in), 5V_EXT_VOUT, 5V_PGOOD (out), VIN_5V

### Nets
GND: C24.2 C30.2 C35.2 C37.2 C38.2 C40.2 C41.2 C42.2 C43.2 C44.2 R9.1 U6.3(PGND) U6.13(PGND) U6.16(AGND) U6.25(AGND)
5V_EN: U6.19(EN) ; port 5V_EN
5V_EXT_VOUT: C30.1 C35.1 C38.1 C44.1 L1.2 R7.2 U6.18(VOUT) ; port 5V_EXT_VOUT
5V_PGOOD: U6.14(PGOOD) ; port 5V_PGOOD
SIC_FB: R7.1 R9.2 U6.17(FB)
SIC_MD1: R24.1 U6.21(MODE1)
SIC_MD2: R35.1 U6.20(MODE2)
SIC_SW: L1.1 U6.5(SW)
SIC_VDD: C40.1 R24.2 R35.2 U6.15(VDD)
SIC_VDRV: C41.1 U6.12(VDRV)
VIN_5V: C24.1 C37.1 C42.1 C43.1 U6.1(VIN) U6.22(VIN) ; port VIN_5V
NetC13_1: C13.1 R48.2
NetC13_2: C13.2 U6.23(BOOT)
NetR48_1: R48.1 U6.24(PHASE)

Not connected (* = marked no-connect by the designer): U6 10(GL)* 11(GL)* 28(GL)*

### Notes on the sheet
- 5V regulator tuned to put out 5.1V
- (near C41) FB target voltage = 0.6V

### Library data of the parts
C13 = C_0402_0.1uF_16V_10%: CAP CERM 0.1uF 10% 16V 0402; Package: =SelectedPackage; Voltage: 16V; Temperature Coefficient: X7R; Supplier 1: Digi-Key; Supplier Part Number 1: 1276-1001-1-ND; Supplier 2: Digi-Key; Supplier Part Number 2: 587-1451-1-ND
C24 C37 C42 C43 = C_0805_10uF_25V_10%: CAP CER 10UF 25V X5R 0805; Package: =SelectedPackage; Voltage: 25V; Temperature Coefficient: X5R; Supplier 1: Digi-Key; Supplier Part Number 1: 1276-2891-1-ND
C30 C35 C38 C44 = C_1210_100uF_6.3V_20%: CAP CER 100UF 6.3V 20% X5R 1210; SVP Creator: Spencer Berglund; Package: 1210; Supplier 1: Digi-Key; Supplier Part Number 1: 445-1437-1-ND
C40 = C_0603_1uF_16V_10%: as C1 on sheet Batt_Meas; Package: =SelectedPackage; Voltage: 16V; Temperature Coefficient: X7R; Supplier 1: Digi-Key; Supplier Part Number 1: 1276-6524-6-ND
C41 = C_0805_4.7uF_16V_10%: as C29 on sheet Power_Regulation; Package: =SelectedPackage; Voltage: 16V; Temperature Coefficient: X5R; Supplier 1: Digi-Key; Supplier Part Number 1: 1276-1065-6-ND
L1 = L_104CDMCCDS-1R5MC: 1.5µH Shielded Molded Inductor 19A 4.2mOhm Max Nonstandard; Manufacturer: Sumida; DC Resistance (DCR): 4.2mR; Core Material: Metal; Saturation Current: 29A; Test Frequency: 100kHz; Tolerance: 20%; Supplier 1: Digi-Key; Supplier 2: Mouser; Supplier Part Number 1: 308-2497-1-ND; Supplier Part Number 2: 851-104CDMCCDS-1R5MC; Manufacturer Part Number: 104CDMCCDS-1R5MC; Inductance: 1.5uH; Current Rating: 19A; Min Operating Temperature: -55°C; Max Operating Temperature: 125°C
R7 R9 R24 R35 R48 = R_0402_generic_1%: as R1 on sheet Batt_Meas; Operating Temperature: -55°C ~ 155°C; Manufacturer Part Number: ='RC0402FR-07'+ValueFormatted+'L'; HelpURL: https://www.digikey.com/products/en/resistors/chip-resistor-surface-mount/52?pv17=103&FV=fffc000d%2Cc0001%2C1c0002%2C1f140000%2Cffe00034&k=RC0402; ValueFormatted: =Copy(Copy(Value, 0, Pos('.', Value)-1)+Copy(Value, Length(Value), 1)+Copy(Value, Pos('.', Value)+1, Length(Value)-Pos('.', Value)-1),1,Pos('.',Value)*Length(Value))+Copy(Value,1,Length(Value)*(1-Pos('.',Value)))
U6 = U_SIC437DED: Buck Switching Regulator IC Positive Adjustable 0.6V 1 Output 12A 24-PowerWFQFN; Manufacturer: Vishay; Supplier 1: Digi-Key; Supplier 2: Mouser; Supplier Part Number 1: SIC437DED-T1-GE3CT-ND; Supplier Part Number 2: 78-SIC437DED-T1-GE3; Manufacturer Part Number: SIC437DED-T1-GE3

## Sheet Temp_Meas.SchDoc
size A
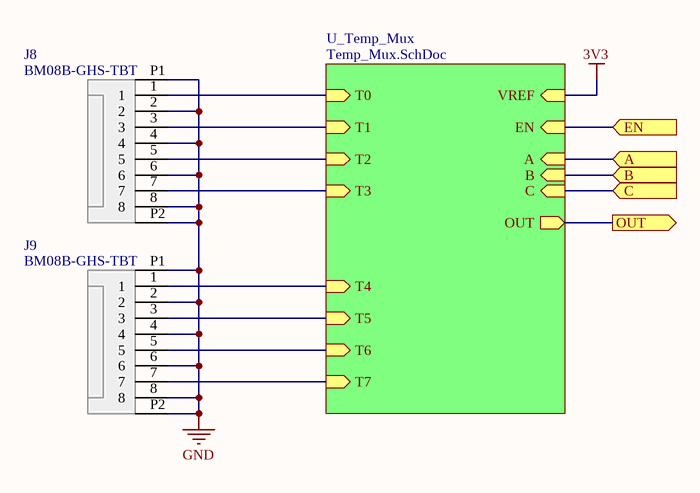
[diagram p8: Temp_Meas.SchDoc]

### Parts
J8  BM08B-GHS-TBT  [J_BM08B-GHS-TBT]
J9  BM08B-GHS-TBT  [J_BM08B-GHS-TBT]

### Sub-sheets
U_Temp_Mux = Temp_Mux.SchDoc: T0 (in), A (in), B (in), EN (in), OUT (out), T1 (in), T2 (in), T3 (in), T4 (in), T5 (in), T6 (in), T7 (in), VREF (in), C (in)

### Ports
A (in), B (in), C (in), EN (in), OUT (out)

### Nets
GND: J8.2 J8.4 J8.6 J8.8 J8.P1 J8.P2 J9.2 J9.4 J9.6 J9.8 J9.P1 J9.P2
A: port A, sheet U_Temp_Mux/A
B: port B, sheet U_Temp_Mux/B
C: port C, sheet U_Temp_Mux/C
EN: port EN, sheet U_Temp_Mux/EN
OUT: port OUT, sheet U_Temp_Mux/OUT
T0: J8.1 ; sheet U_Temp_Mux/T0
T1: J8.3 ; sheet U_Temp_Mux/T1
T2: J8.5 ; sheet U_Temp_Mux/T2
T3: J8.7 ; sheet U_Temp_Mux/T3
T4: J9.1 ; sheet U_Temp_Mux/T4
T5: J9.3 ; sheet U_Temp_Mux/T5
T6: J9.5 ; sheet U_Temp_Mux/T6
T7: J9.7 ; sheet U_Temp_Mux/T7

### Library data of the parts
J8 J9 = J_BM08B-GHS-TBT: Connector Header Surface Mount 8 position 0.049" (1.25mm); Manufacturer: JST; Manufacturer Part Number: BM08B-GHS-TBT(LF)(SN); Current Rating: 1A; Voltage Rating: 50V; Wire/Cable Gauge: 26AWG; Supplier 1: Digi-Key; Supplier Part Number 1: 455-1584-1-ND; Contact Material: Bronze; Contact Plating: Tin; Housing Material: Nylon; Max Operating Temperature: 85°C; Min Operating Temperature: -25°C; Pitch: 1.25mm; Voltage Rating (AC): 50V

## Sheet Temp_Mux.SchDoc
size A
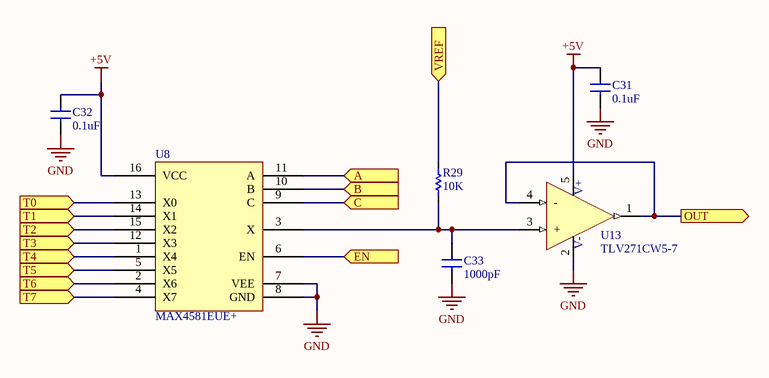
[diagram p9: Temp_Mux.SchDoc]

### Parts
C31  value 0.1uF  [0402_CAPACITOR]  (hidden comment: CAP 0.1uF 16V X7R)
C32  value 0.1uF  [0402_CAPACITOR]  (hidden comment: CAP 0.1uF 16V X7R)
C33  value 1000pF  [0402_CAPACITOR]
R29  value 10K  [0402_Resistor]  (hidden comment: R_0402_10K_1%)
U8  MAX4581EUE+  [TSSOP-16]
U13  TLV271CW5-7  [SOT23-5]

### Ports
A (in), B (in), C (in), EN (in), OUT (out), T0 (in), T1 (in), T2 (in), T3 (in), T4 (in), T5 (in), T6 (in), T7 (in), VREF (in)

### Nets
3V3: R29.2 ; port VREF
+5V: C31.1 C32.1 U8.16(VCC) U13.5(VDD)
GND: C31.2 C32.2 C33.2 U8.7(VEE) U8.8(GND) U13.2(GND)
A: U8.11(A) ; port A
B: U8.10(B) ; port B
C: U8.9(C) ; port C
EN: U8.6(EN) ; port EN
OUT: U13.1(OUT) U13.4(-) ; port OUT
T0: U8.13(X0) ; port T0
T1: U8.14(X1) ; port T1
T2: U8.15(X2) ; port T2
T3: U8.12(X3) ; port T3
T4: U8.1(X4) ; port T4
T5: U8.5(X5) ; port T5
T6: U8.2(X6) ; port T6
T7: U8.4(X7) ; port T7
NetC33_1: C33.1 R29.1 U8.3(X) U13.3(+)

### Notes on the sheet
- (in symbol U_TLV271) V+; V-

### Library data of the parts
C31 C32 = C_0402_0.1uF_16V_10%: CAP CERM 0.1uF 10% 16V 0402; Package: =SelectedPackage; Voltage: 16V; Temperature Coefficient: X7R; Supplier 1: Digi-Key; Supplier Part Number 1: 1276-1001-1-ND; Supplier 2: Digi-Key; Supplier Part Number 2: 587-1451-1-ND
C33 = C_0402_generic_C0G/NP0_50V_5%: Generic 0402 C0G/NP0 50V 5% ceramic capacitor / Valid values range from 10pF to 1000pF with E24 selection (1.0, 1.1, 1.2, 1.3, 1.5, 1.6, 1.8, 2.0, 2.2, 2.4, 2.7, 3.0, 3.3, 3.6, 3.9, 4.3, 4.7, 5.1, 5.6, 6.2, 6.8, 7.5, 8.2, 9.1), although E12 are more common; Manufacturer: Samsung; Temperature Coefficient: C0G, NP0; Package: =SelectedPackage; Voltage: 50V; ValueFormatted: =Copy(Value,0,2)+Copy('012',Pos('p',Value)-2,1); Manufacturer Part Number: ='CL05C'+ValueFormatted+'JB5NNNC'; HelpURL: https://www.digikey.com/products/en/capacitors/ceramic-capacitors/60?k=&pkeyword=&sv=0&pv405=19&sf=0&FV=fffc04fc%2Cc0002%2Cc0003%2C1c0002%2C380020%2C400004%2C440012%2C3f00019%2C1f140000%2Cffe0003c%2Cmu1000pF%7C2049%2Cmu100pF%7C2049%2Cmu10pF%7C2049%2Cmu11pF%7C2049%2Cmu120pF%7C2049%2Cmu12pF%7C2049%2Cmu13pF%7C2049%2Cmu150pF%7C2049%2Cmu15pF%7C2049%2Cmu16pF%7C2049%2Cmu180pF%7C2049%2Cmu18pF%7C2049%2Cmu200pF%7C2049%2Cmu20pF%7C2049%2Cmu220pF%7C2049%2Cmu22pF%7C2049%2Cmu24pF%7C2049%2Cmu270pF%7C2049%2Cmu27pF%7C2049%2Cmu30pF%7C2049%2Cmu330pF%7C2049%2Cmu33pF%7C2049%2Cmu36pF%7C2049%2Cmu390pF%7C2049%2Cmu39pF%7C2049%2Cmu470pF%7C2049%2Cmu47pF%7C2049%2Cmu51pF%7C2049%2Cmu560pF%7C2049%2Cmu56pF%7C2049%2Cmu62pF%7C2049%2Cmu680pF%7C2049%2Cmu68pF%7C2049%2Cmu75pF%7C2049%2Cmu820pF%7C2049%2Cmu82pF%7C2049%2Cmu91pF%7C2049&ColumnSort=2049
R29 = R_0402_generic_1%: as R1 on sheet Batt_Meas; Operating Temperature: -55°C ~ 155°C; Manufacturer Part Number: ='RC0402FR-07'+ValueFormatted+'L'; HelpURL: https://www.digikey.com/products/en/resistors/chip-resistor-surface-mount/52?pv17=103&FV=fffc000d%2Cc0001%2C1c0002%2C1f140000%2Cffe00034&k=RC0402; ValueFormatted: =Copy(Copy(Value, 0, Pos('.', Value)-1)+Copy(Value, Length(Value), 1)+Copy(Value, Pos('.', Value)+1, Length(Value)-Pos('.', Value)-1),1,Pos('.',Value)*Length(Value))+Copy(Value,1,Length(Value)*(1-Pos('.',Value)))
U8 = U_MAX4581: 1 Circuit IC Switch 8:1 80 Ohm 16-TSSOP; Supplier 1: Digi-Key; Supplier Part Number 1: MAX4581EUE+-ND
U13 = U_TLV271: CMOS Amplifier 1 Circuit Rail-to-Rail SOT-25; Manufacturer: Diodes; Output Current per Channel: 8mA; Power Dissipation: 220mW; Min Dual Supply Voltage: 1.35V; Operating Supply Current: 550uA; Common Mode Rejection Ratio: 65dB; Voltage Gain: 110dB; Slew Rate: 2V/µs; Input Bias Current: 1pA; Power Supply Rejection Ratio (PSRR): 70dB; Input Offset Voltage (Vos): 500uV; Unity Gain Bandwidth Product: 1.9MHz; Max Supply Voltage: 16V; Max Frequency: 10kHz; Min Supply Voltage: 2.7V; Supplier 1: Digi-Key; Supplier Part Number 1: TLV271CW5-7DIDKR-ND; Width: 1.7mm; Max Operating Temperature: 70°C; Min Operating Temperature: 0°C; Manufacturer Part Number: TLV271CW5-7; Gain Bandwidth Product: 1.9MHz

## Sheet IMU.SchDoc
size A
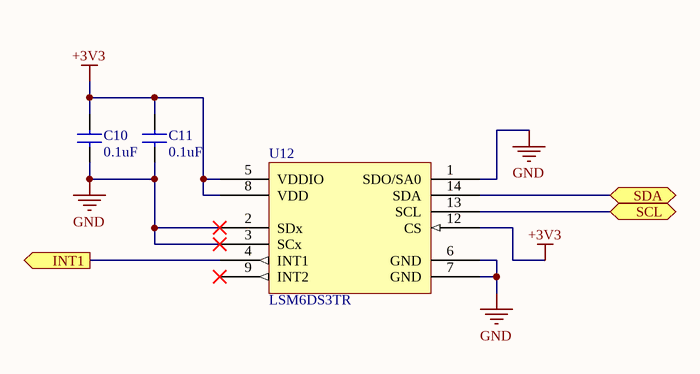
[diagram p10: IMU.SchDoc]

### Parts
C10  value 0.1uF  [0402_CAPACITOR]  (hidden comment: CAP 0.1uF 16V X7R)
C11  value 0.1uF  [0402_CAPACITOR]  (hidden comment: CAP 0.1uF 16V X7R)
U12  LSM6DS3TR  [LGA-14_2.5x3mm]

### Ports
INT1 (out), SCL (bidir), SDA (bidir)

### Nets
+3V3: C10.2 C11.2 U12.5(VDDIO) U12.8(VDD) U12.12(CS)
GND: C10.1 C11.1 U12.1(SDO/SA0) U12.2(SDx) U12.3(SCx) U12.6(GND) U12.7(GND)
IMU_INT1: U12.4(INT1) ; port INT1
PMON/IMU_SCL: U12.13(SCL) ; port SCL
PMON/IMU_SDA: U12.14(SDA) ; port SDA

Not connected (* = marked no-connect by the designer): U12 9(INT2)*

### Library data of the parts
C10 C11 = C_0402_0.1uF_16V_10%: CAP CERM 0.1uF 10% 16V 0402; Package: =SelectedPackage; Voltage: 16V; Temperature Coefficient: X7R; Supplier 1: Digi-Key; Supplier Part Number 1: 1276-1001-1-ND; Supplier 2: Digi-Key; Supplier Part Number 2: 587-1451-1-ND
U12 = U_LSM6DS3: Accelerometer, Gyroscope, Temperature, 3 Axis Sensor I²C, SPI Output; Supplier 1: Digi-Key; Supplier 2: Mouser; Supplier Part Number 1: 497-15383-1-ND; Supplier Part Number 2: 511-LSM6DS3TR